# EAGLE design etch-a-sketch (EAGLE 9.6.2)
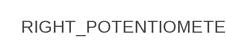
[diagram p0: schematic, sheet 1, part 1 of 2]
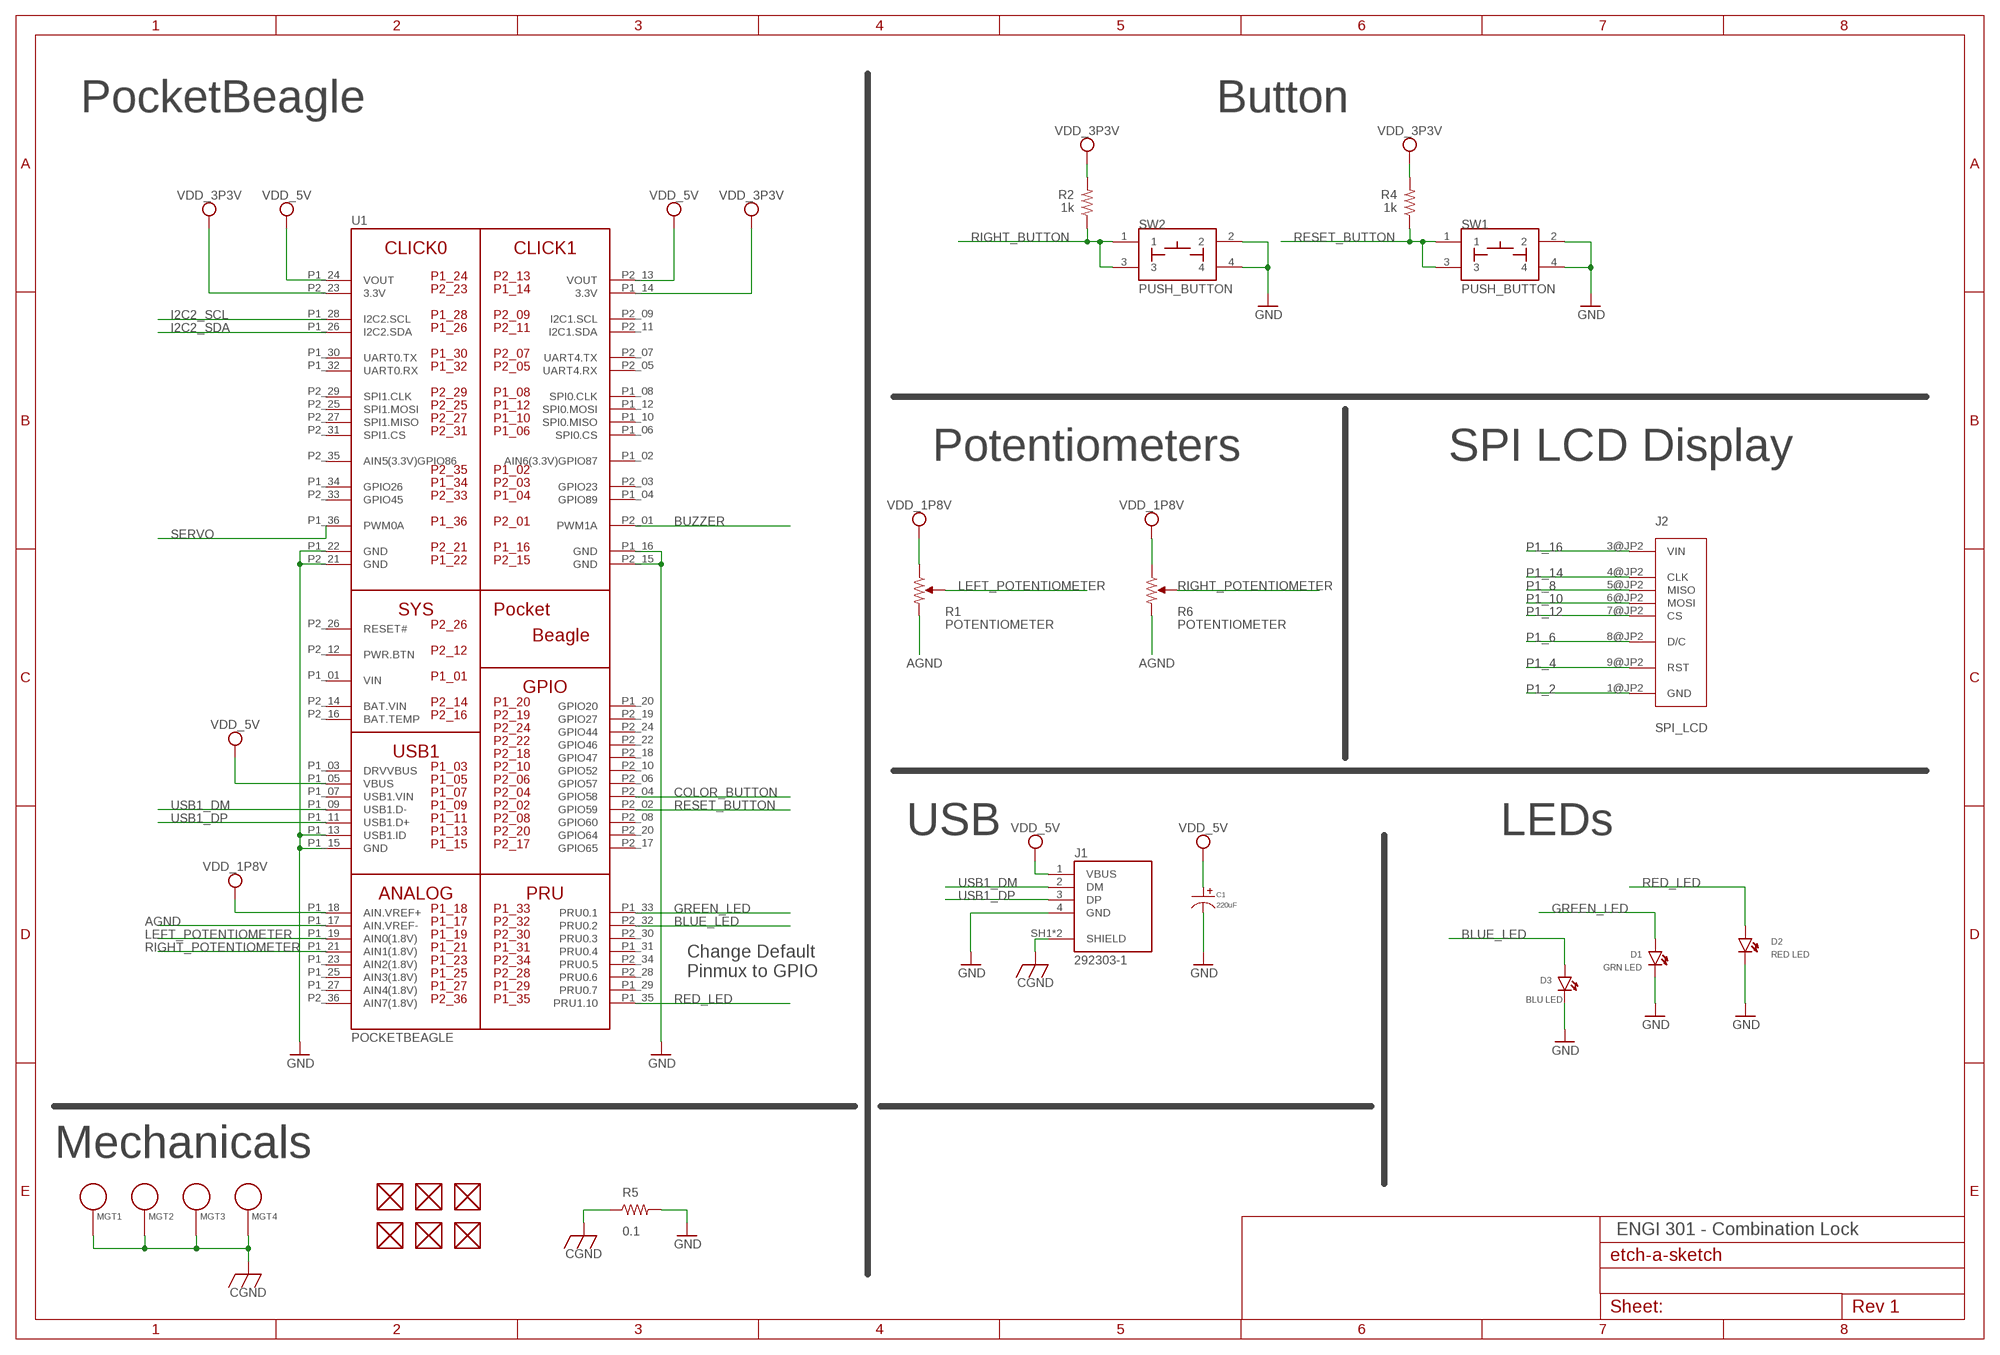
[diagram p1: schematic, sheet 1, part 2 of 2]

## Parts
C1  220uF  CAPACITOR_P_10MM  [CP10MM]
D1  GRN LED  LED  [EIA-STD]
D2  RED LED  LED  [EIA-STD]
D3  GRN LED  LED  [EIA-STD]
FUD1  FIDUCIAL  [FIDUCIAL_40MIL]
FUD2  FIDUCIAL  [FIDUCIAL_40MIL]
FUD3  FIDUCIAL  [FIDUCIAL_40MIL]
FUD4  FIDUCIAL  [FIDUCIAL_40MIL]
FUD5  FIDUCIAL  [FIDUCIAL_40MIL]
FUD6  FIDUCIAL  [FIDUCIAL_40MIL]
J1  292303-1  [TE_292303-1]
J2  SPI_LCD  [TFT_LCD_PCB]
MGT1  MOUNTING_HOLE  [MOUNTING_HOLE]
MGT2  MOUNTING_HOLE  [MOUNTING_HOLE]
MGT3  MOUNTING_HOLE  [MOUNTING_HOLE]
MGT4  MOUNTING_HOLE  [MOUNTING_HOLE]
R1  POTENTIOMETER  [POT-PO90S]
R2  1k  R_R0603  [R0603]
R4  1k  R_R0603  [R0603]
R5  0.1  R_R0805  [R0805]
R6  POTENTIOMETER  [POT-PO90S]
SW1  PUSH_BUTTON  [BUTTON_12.5MM]
SW2  PUSH_BUTTON  [BUTTON_12.5MM]
U1  POCKETBEAGLE  [POCKETBEAGLE]

## Nets
AGND: R1.CW R6.CW U1.P1_17(AIN.VREF-)
AGND1: U1.P1_21(AIN1(1.8V))
BUTTON1: U1.P2_04(GPIO58)
BUZZER: U1.P2_01(PWM1A)
CGND: J1.SH1(SHIELD) J1.SH2(SHIELD) MGT1.P$1 MGT2.P$1 MGT3.P$1 MGT4.P$1 R5.1
GND: C1.P$2 D1.CATHODE D2.CATHODE D3.CATHODE J1.4(GND) R5.2 SW1.2 SW1.4 SW2.2 SW2.4 U1.P1_13(USB1.ID) U1.P1_15(GND) U1.P1_16(GND) U1.P1_22(GND) U1.P2_15(GND) U1.P2_21(GND)
GREEN_LED: D1.ANODE D3.ANODE U1.P1_33(PRU0.1)
GREEN_LED1: U1.P2_32(PRU0.2)
I2C2_SCL: U1.P1_28(I2C2.SCL)
I2C2_SDA: U1.P1_26(I2C2.SDA)
LEFT_POTENTIOMETER: R1.S R6.S U1.P1_19(AIN0(1.8V))
N$1: J2.3@JP2(VIN)
N$2: J2.4@JP2(CLK)
N$3: J2.5@JP2(MISO)
N$4: J2.6@JP2(MOSI)
N$5: J2.7@JP2(CS)
N$6: J2.8@JP2(D/C)
N$7: J2.9@JP2(RST)
N$8: J2.1@JP2(GND)
RED_LED: D2.ANODE U1.P1_35(PRU1.10)
RESET_BUTTON: R2.1 R4.1 SW1.1 SW1.3 SW2.1 SW2.3 U1.P2_02(GPIO59)
SERVO: U1.P1_36(PWM0A)
USB1_DM: J1.2(DM) U1.P1_09(USB1.D-)
USB1_DP: J1.3(DP) U1.P1_11(USB1.D+)
VDD_1P8V: R1.CCW R6.CCW U1.P1_18(AIN.VREF+)
VDD_3P3V: R2.2 R4.2 U1.P1_14(3.3V) U1.P2_23(3.3V)
VDD_5V: C1.P$1 J1.1(VBUS) U1.P1_05(VBUS) U1.P1_24(VOUT) U1.P2_13(VOUT)
Unconnected: FUD1.P$1 FUD2.P$1 FUD3.P$1 FUD4.P$1 FUD5.P$1 FUD6.P$1 U1.P1_02(AIN6(3.3V)GPIO87) U1.P1_03(DRVVBUS) U1.P1_04(GPIO89) U1.P1_06(SPI0.CS) U1.P1_07(USB1.VIN) U1.P1_08(SPI0.CLK) U1.P1_10(SPI0.MISO) U1.P1_12(SPI0.MOSI) U1.P1_20(GPIO20) U1.P1_23(AIN2(1.8V)) U1.P1_25(AIN3(1.8V)) U1.P1_27(AIN4(1.8V)) U1.P1_29(PRU0.7) U1.P1_30(UART0.TX) U1.P1_31(PRU0.4) U1.P1_32(UART0.RX) U1.P1_34(GPIO26) U1.P2_03(GPIO23) U1.P2_05(UART4.RX) U1.P2_06(GPIO57) U1.P2_07(UART4.TX) U1.P2_08(GPIO60) U1.P2_09(I2C1.SCL) U1.P2_10(GPIO52) U1.P2_11(I2C1.SDA) U1.P2_12(PWR.BTN) U1.P2_16(BAT.TEMP) U1.P2_17(GPIO65) U1.P2_18(GPIO47) U1.P2_19(GPIO27) U1.P2_20(GPIO64) U1.P2_22(GPIO46) U1.P2_24(GPIO44) U1.P2_25(SPI1.MOSI) U1.P2_26(RESET#) U1.P2_27(SPI1.MISO) U1.P2_28(PRU0.6) U1.P2_29(SPI1.CLK) U1.P2_30(PRU0.3) U1.P2_31(SPI1.CS) U1.P2_33(GPIO45) U1.P2_34(PRU0.5) U1.P2_35(AIN5(3.3V)GPIO86) U1.P2_36(AIN7(1.8V))

## Notes on the sheet
- PocketBeagle | Button
- RIGHT_BUTTON
- Potentiometers | SPI LCD Display
- P1_16
- P1_14
- RIGHT_POTENTIOMETER | P1_8
- P1_10
- P1_12
- P1_6
- P1_4
- P1_2
- COLOR_BUTTON
- USB | LEDs
- BLUE_LED
- BLUE_LED
- RIGHT_POTENTIOMETER
- Change Default 
  Pinmux to GPIO
- BLU LED
- Mechanicals
- ENGI 301 - Combination Lock
- RIGHT_POTENTIOMETER

## Power pins joined to a net without a drawn wire
BAT.VIN: U1.P2_14(BAT.VIN)
VIN: U1.P1_01(VIN)

## Library data of the parts
C1 = combo_lock:CAPACITOR_P: Library: MF_Passives Description: Device for Polarized Capacitors. Manufacture part number (MPN), Voltage Rating, and Tolerance can be added via Attributes. Check https://factory.macrofab.com/parts for the house parts list.; POPULATE: 1
D1-D3 = combo_lock:LED: EIA-STD LED, LTST-C191TBKT
FUD1-FUD6 = combo_lock:FIDUCIAL
J1 = combo_lock:292303-1: CONN USB RECEPT R/A TYPE A 4POS Check availability <https://pricing.snapeda.com/parts/292303-1/TE%20Connectivity/view-part?ref=eda>; AVAILABILITY: In Stock; CENTERLINE_PITCH: 2 mm[.078 in]; COMMENT: 292303-1; DESCRIPTION: Conn; Data; USB; Recept; 2.0; 4 Pos; 1 Port; Rt Angle; A Ser; Tin over Copper; EU_ROHS_COMPLIANCE: Compliant; MF: TE Connectivity; MP: 292303-1; NUMBER_OF_POSITIONS: 4; PACKAGE: None; PRICE: None; PRODUCT_TYPE: Connector; PURCHASE-URL: https://pricing.snapeda.com/search/part/292303-1/?ref=eda
J2 = Etch-a-sketch:SPI_LCD
MGT1-MGT4 = combo_lock:MOUNTING_HOLE: Chassis Mounting Hole w/GND connection ability
R1 R6 = combo_lock:POTENTIOMETER: Potentiometer - Examples: P090S-14T20BR10K (987-1277-ND)
R2 R4 R5 = combo_lock:R_: RESISTOR, American symbol
SW1 SW2 = combo_lock:PUSH_BUTTON
U1 = combo_lock:POCKETBEAGLE

## Board
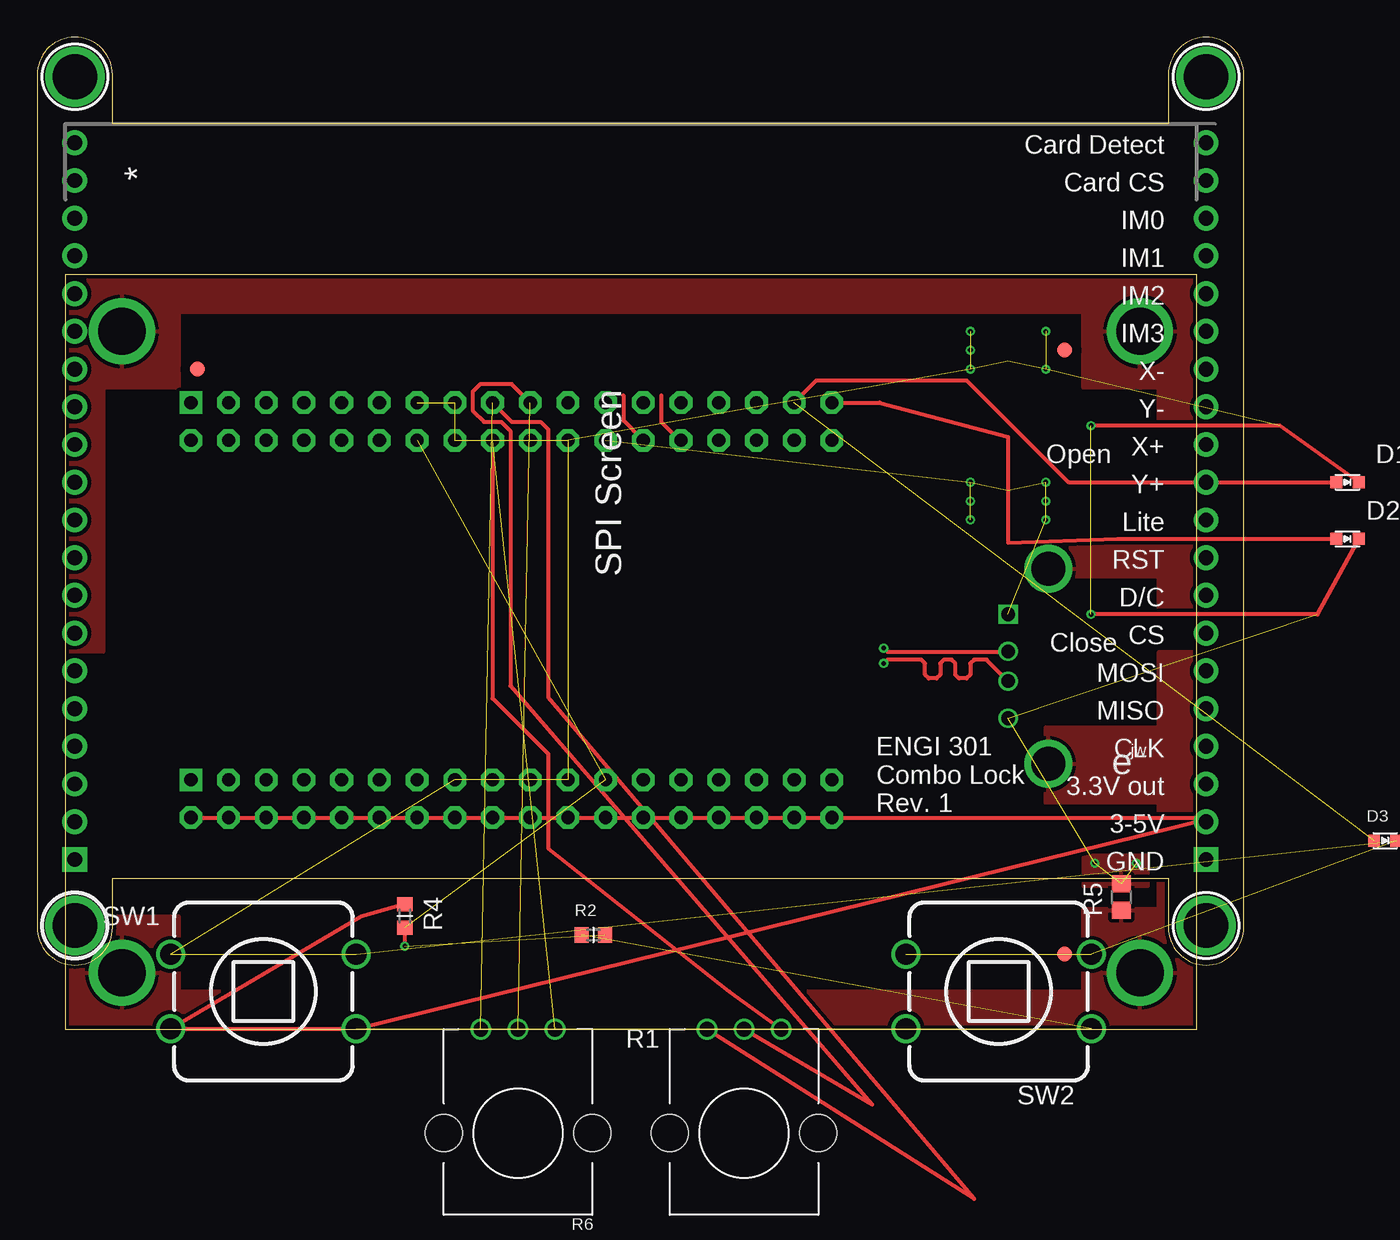
[diagram p2: board, top side]
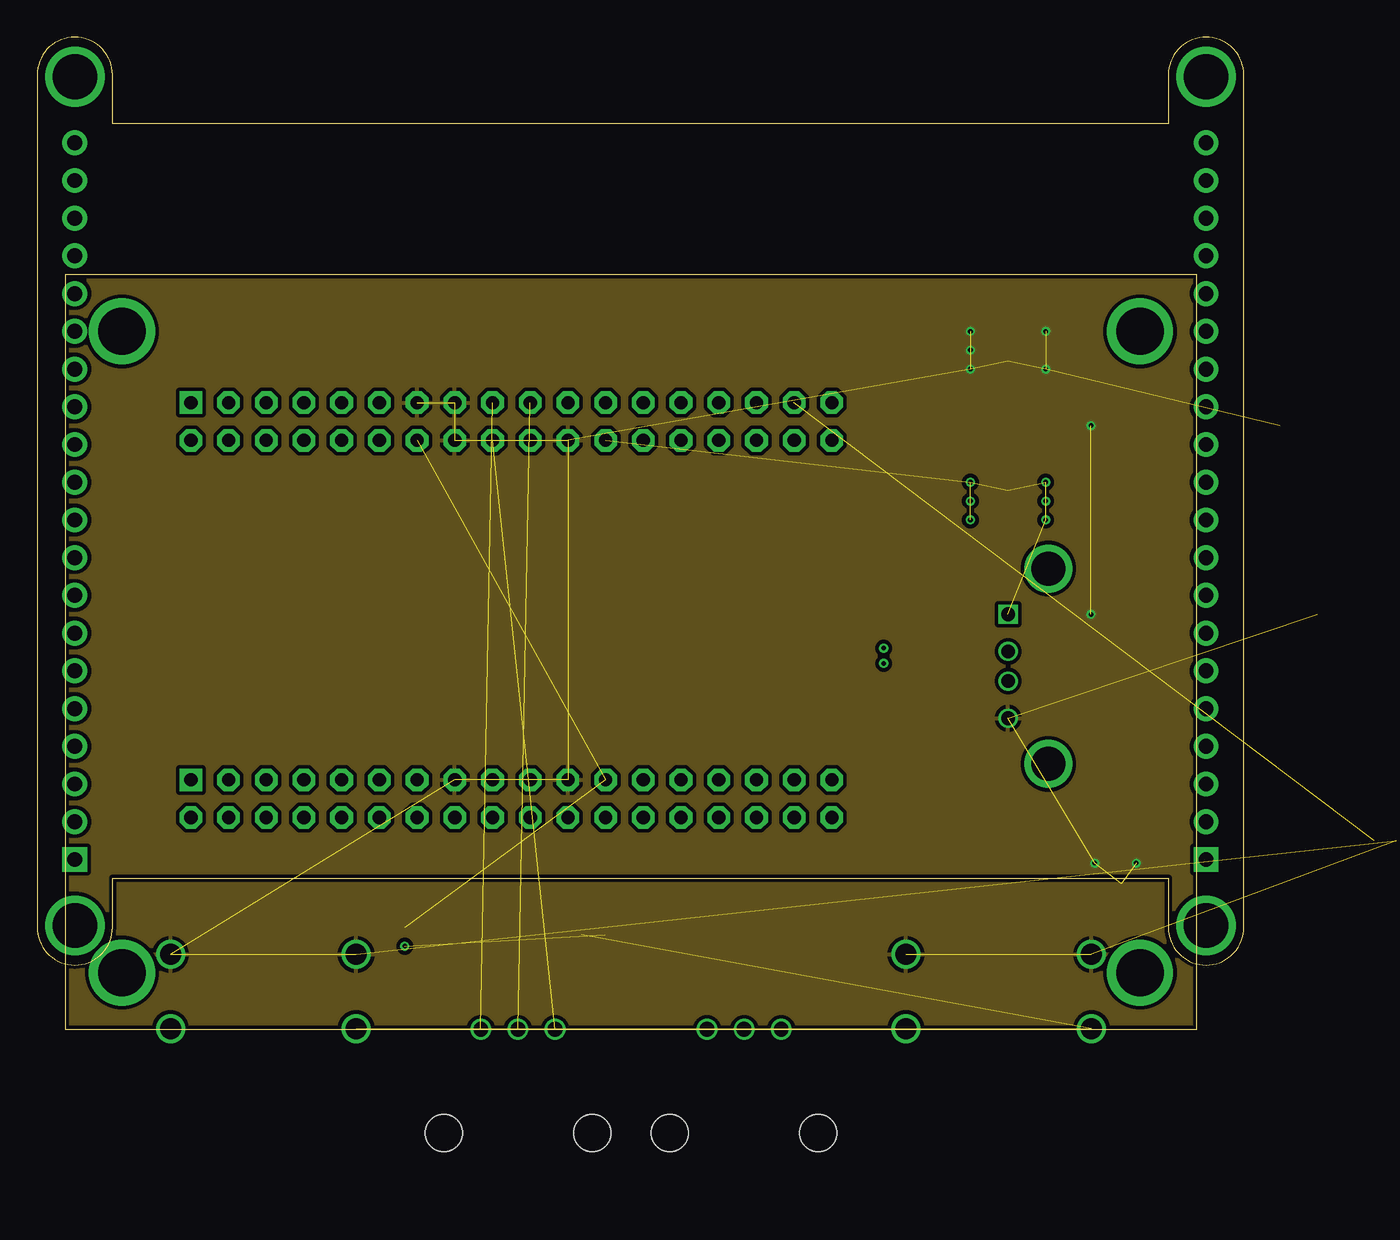
[diagram p3: board, inner layer Route2]
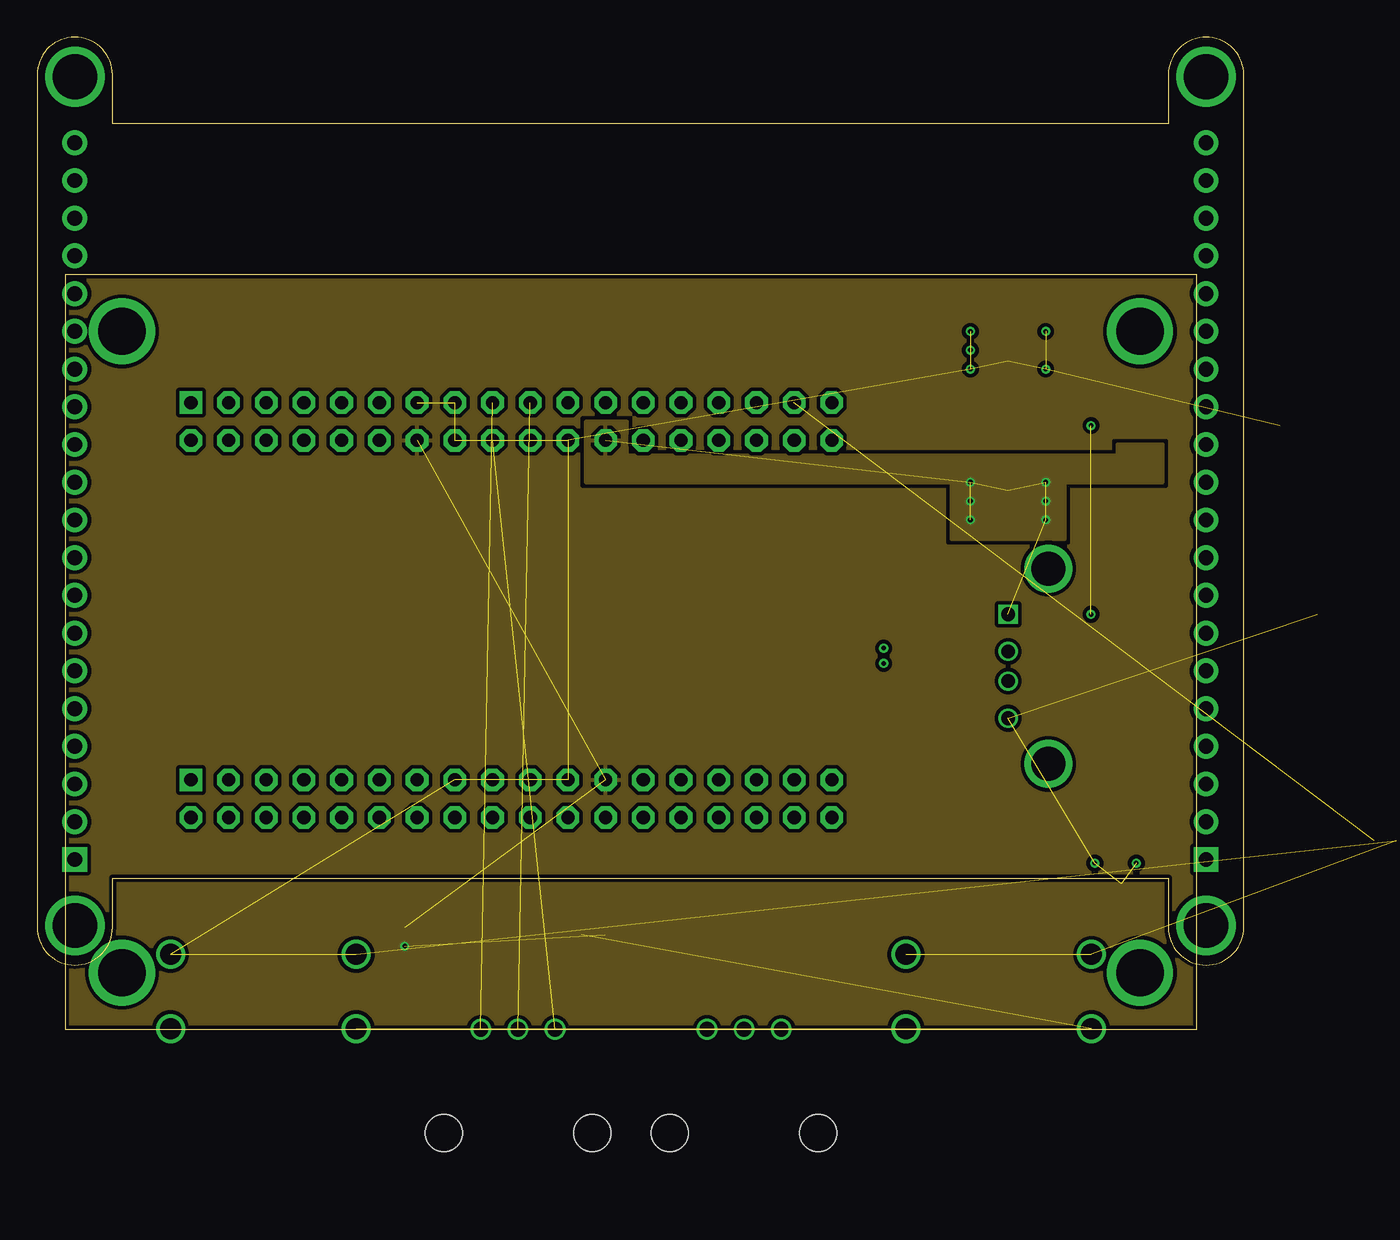
[diagram p4: board, inner layer Route15]
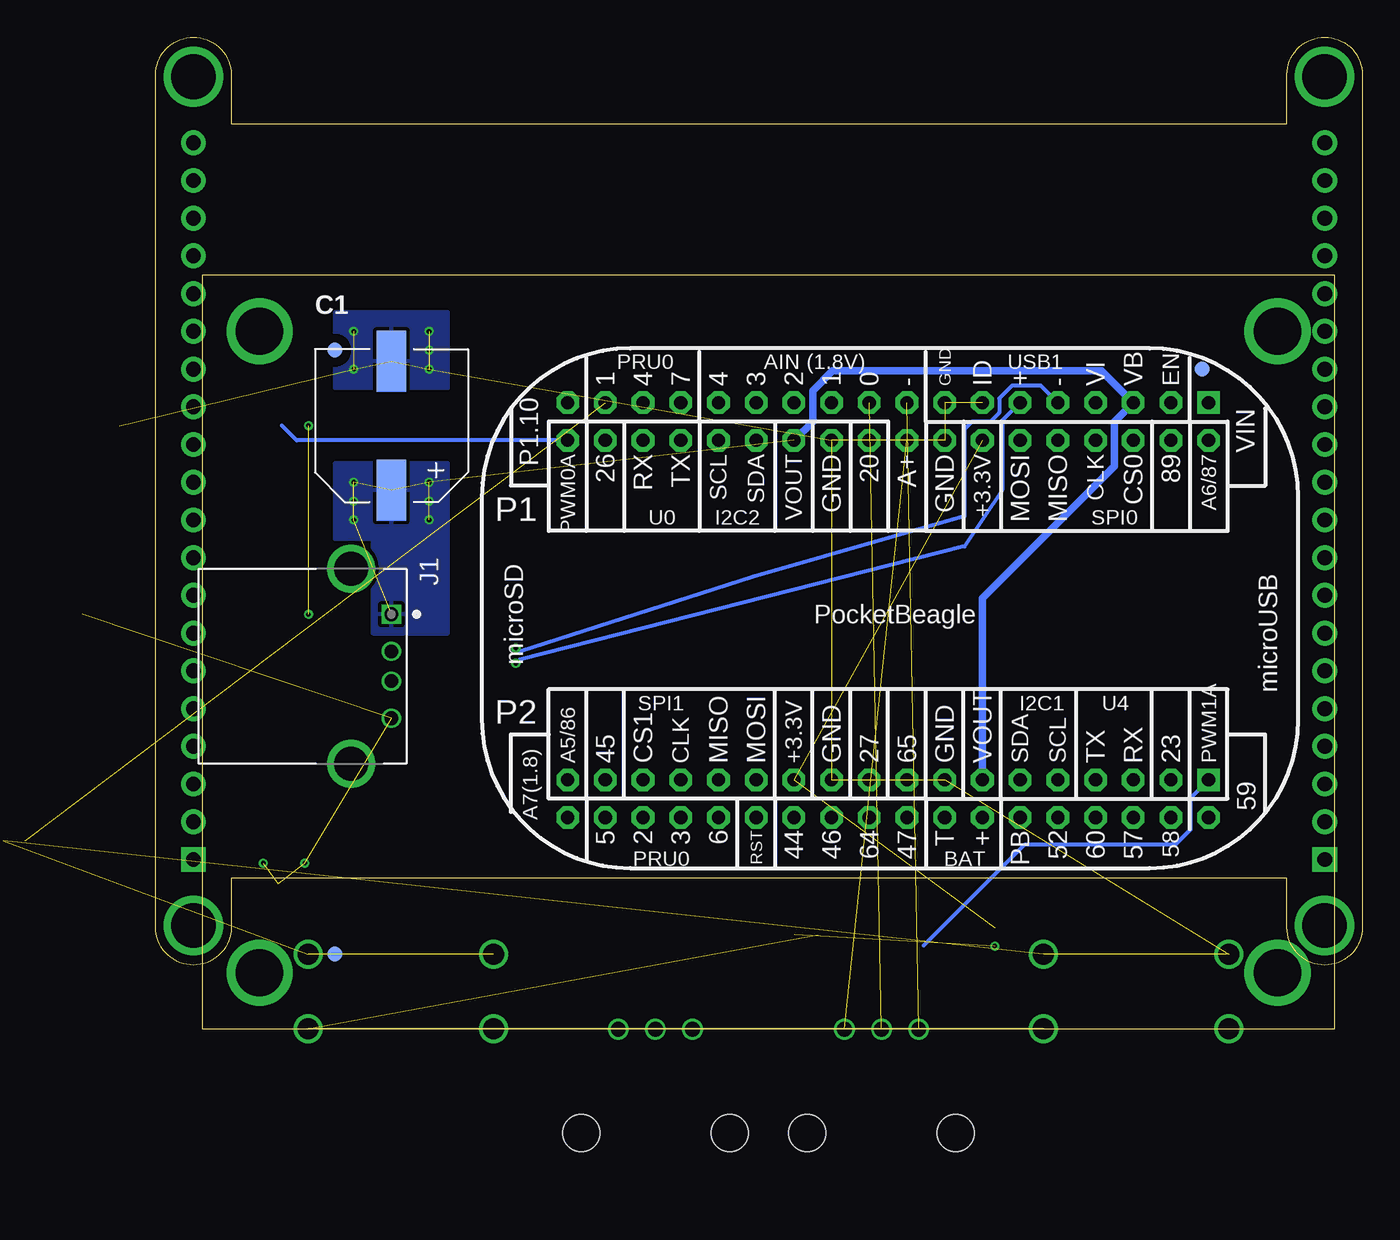
[diagram p5: board, bottom side, seen from below]

Size 81.28 x 66.8 mm. Coordinates in mm from the lower left corner, seen from the top.
Outline: 1.91,0 78.11,0 78.11,50.8 1.91,50.8 1.91,0
Copper layers (1*2*15*16): Top 0.035mm / dielectric 0.23mm / Route2 0.035mm / dielectric 0.93mm / Route15 0.035mm / dielectric 0.23mm / Bottom 0.035mm
Design rules "ENGI301_4lyr": minimum track width 10mil, minimum drill 12mil, track to track 10mil, track to pad 10mil, pad to pad 10mil, via to via 10mil, smd to smd 10mil, copper to edge 10mil, drill to drill 12mil, minimum pad ring 6mil, minimum via ring 6mil, stop-mask expansion 3mil, vias tented up to drill 25mil, thermal gap 10mil

### Footprints (pad centres in the part's own frame; a part is rotated, then mirrored left to right if it is on the bottom)
CP10MM = smd 2 x 4.1: P$1 0,-4.35; P$2 0,4.35
EIA-STD = smd 0.8 x 0.8: ANODE -0.75,0; CATHODE 0.75,0
FIDUCIAL_40MIL = smd 1.016 x 1.016: P$1 0,0
TE_292303-1 = drill 0.92 square: 1 0,0 | drill 0.92: 2 2.5,0; 3 4.5,0; 4 7,0 | drill 2.3: SH1 -3.07,-2.71; SH2 10.07,-2.71
TFT_LCD_PCB = drill 1 pad 1.676 square: 1@JP1 -24.13,38.1; 1@JP2 -24.13,-38.1 | drill 1 pad 1.676: 2@JP1 -21.59,38.1; 2@JP2 -21.59,-38.1; 3@JP1 -19.05,38.1; 3@JP2 -19.05,-38.1; 4@JP1 -16.51,38.1; 4@JP2 -16.51,-38.1; 5@JP1 -13.97,38.1; 5@JP2 -13.97,-38.1; 6@JP1 -11.43,38.1; 6@JP2 -11.43,-38.1; 7@JP1 -8.89,38.1; 7@JP2 -8.89,-38.1; 8@JP1 -6.35,38.1; 8@JP2 -6.35,-38.1; 9@JP1 -3.81,38.1; 9@JP2 -3.81,-38.1; 10@JP1 -1.27,38.1; 10@JP2 -1.27,-38.1; 11@JP1 1.27,38.1; 11@JP2 1.27,-38.1; 12@JP1 3.81,38.1; 12@JP2 3.81,-38.1; 13@JP1 6.35,38.1; 13@JP2 6.35,-38.1; 14@JP1 8.89,38.1; 14@JP2 8.89,-38.1; 15@JP1 11.43,38.1; 15@JP2 11.43,-38.1; 16@JP1 13.97,38.1; 16@JP2 13.97,-38.1; 17@JP1 16.51,38.1; 17@JP2 16.51,-38.1; 18@JP1 19.05,38.1; 18@JP2 19.05,-38.1; 19@JP1 21.59,38.1; 19@JP2 21.59,-38.1; 20@JP1 24.13,38.1; 20@JP2 24.13,-38.1 | drill 3 pad 3.6: P$1@U$7 -28.575,-38.1; P$1@U$15 28.575,-38.1; P$1@U$16 -28.575,38.1; P$1@U$17 28.575,38.1
MOUNTING_HOLE = drill 3.175 pad 4.445: P$1 0,0
POT-PO90S = drill 1: CCW -2.5,0; CW 2.5,0; S 0,0 | hole 2.5: -5,7; 5,7
R0603 = smd 0.95 x 1.031: 1 -0.8,0; 2 0.8,0
R0805 = smd 1.143 x 1.27: 1 -0.889,0; 2 0.889,0
BUTTON_12.5MM = drill 1.4: 1 -6.25,2.5; 2 -6.25,-2.5; 3 6.25,2.5; 4 6.25,-2.5
POCKETBEAGLE = drill 0.889 pad 1.524 square: P1_01 5.91,3.53; P2_01 5.91,28.93 | drill 0.889 pad 1.524 octagon: P1_02 5.91,6.07; P1_03 8.45,3.53; P1_04 8.45,6.07; P1_05 10.99,3.53; P1_06 10.99,6.07; P1_07 13.53,3.53; P1_08 13.53,6.07; P1_09 16.07,3.53; P1_10 16.07,6.07; P1_11 18.61,3.53; P1_12 18.61,6.07; P1_13 21.15,3.53; P1_14 21.15,6.07; P1_15 23.69,3.53; P1_16 23.69,6.07; P1_17 26.23,3.53; P1_18 26.23,6.07; P1_19 28.77,3.53; P1_20 28.77,6.07; P1_21 31.31,3.53; P1_22 31.31,6.07; P1_23 33.85,3.53; P1_24 33.85,6.07; P1_25 36.39,3.53; P1_26 36.39,6.07; P1_27 38.93,3.53; P1_28 38.93,6.07; P1_29 41.47,3.53; P1_30 41.47,6.07; P1_31 44.01,3.53; P1_32 44.01,6.07; P1_33 46.55,3.53; P1_34 46.55,6.07; P1_35 49.09,3.53; P1_36 49.09,6.07; P2_02 5.91,31.47; P2_03 8.45,28.93; P2_04 8.45,31.47; P2_05 10.99,28.93; P2_06 10.99,31.47; P2_07 13.53,28.93; P2_08 13.53,31.47; P2_09 16.07,28.93; P2_10 16.07,31.47; P2_11 18.61,28.93; P2_12 18.61,31.47; P2_13 21.15,28.93; P2_14 21.15,31.47; P2_15 23.69,28.93; P2_16 23.69,31.47; P2_17 26.23,28.93; P2_18 26.23,31.47; P2_19 28.77,28.93; P2_20 28.77,31.47; P2_21 31.31,28.93; P2_22 31.31,31.47; P2_23 33.85,28.93; P2_24 33.85,31.47; P2_25 36.39,28.93; P2_26 36.39,31.47; P2_27 38.93,28.93; P2_28 38.93,31.47; P2_29 41.47,28.93; P2_30 41.47,31.47; P2_31 44.01,28.93; P2_32 44.01,31.47; P2_33 46.55,28.93; P2_34 46.55,31.47; P2_35 49.09,28.93; P2_36 49.09,31.47

### Placement (x,y rotation side)
C1  65.41,40.64 0 bottom
D1  88.27,36.83 0 top  (outside the outline)
D2  88.27,33.02 0 top  (outside the outline)
D3  90.81,12.7 0 top  (outside the outline)
FUD1  69.22,45.72 0 top
FUD2  69.22,5.08 0 top
FUD3  10.8,44.45 0 bottom
FUD4  69.22,45.72 0 bottom
FUD5  69.22,5.08 0 bottom
FUD6  10.8,44.45 0 top
J1  65.41,27.94 270 bottom
J2  40.64,35.56 90 top
MGT1  5.72,46.99 0 top
MGT2  5.72,3.81 0 top
MGT3  74.3,3.81 0 top
MGT4  74.3,46.99 0 top
R1  47.62,0 180 top
R2  37.47,6.35 0 top
R4  24.77,7.62 270 top
R5  73.03,8.89 90 top
R6  32.39,0 180 top
SW1  15.24,2.54 180 top
SW2  64.77,2.54 180 top
U1  4.45,45.72 180 bottom

### Tracks (layer width: path | path; a pad name or v marks a point on that pad's centre or on a via)
AGND  (1 unrouted)
  Top 0.254: U1.P1_17 31.97,40.89 33.91,40.89 34.42,40.39 34.42,22.35 63.12,-11.43 R1.CW
BUZZER
  Bottom 0.254: U1.P2_01 11.56,15.59 11.56,13.46 12.57,12.45 22.73,12.45 29.54,5.64
CGND
  pour Top: -0.63,-2.54 -0.63,25.4 4.45,25.4 4.45,7.62 9.53,7.62 9.53,2.54 70.48,2.54 70.48,8.13 75.56,8.13 75.56,15.24 67.95,15.24 67.95,20.32 74.3,20.32 75.56,20.32 75.56,21.59 75.56,25.4 80.64,25.4 80.64,-2.54
  pour Top: -0.63,25.4 -0.63,53.34 80.64,53.34 80.64,25.4 75.56,25.4 75.56,30.48 67.95,30.48 67.95,33.02 75.56,33.02 75.56,43.18 70.48,43.18 70.48,48.26 9.53,48.26 9.53,43.18 4.45,43.18 4.45,25.4
GND  (via drill 0.3 pad 0.61)  (22 unrouted)
  Top 0.254: D2.CATHODE 86.23,27.94 v70.99,27.94 | D1.CATHODE 83.69,40.64 v70.99,40.64
  other vias: 71.25,11.18 74.04,11.18 62.87,46.99 62.87,45.72 62.87,44.45 67.95,44.45 67.95,46.99
  pour Route2: -3.17,55.88 80.64,55.88 83.19,55.88 83.19,-5.08 -3.17,-5.08
  pour Top: 70.48,9.65 74.8,9.65 74.8,11.68 70.48,11.68
  pour Bottom: 61.59,43.18 61.59,48.26 69.22,48.26 69.22,43.18
GREEN_LED  (1 unrouted)
  Top 0.254: U1.P1_33 52.49,43.69 62.61,43.69 69.47,36.83 D1.ANODE
I2C2_SCL
  Top 0.254: 42.04,42.67 42.04,40.89 43.28,39.65 U1.P1_28 43.31,39.58
I2C2_SDA
  Top 0.254: U1.P1_26 40.77,39.72 40.69,39.8 39.5,40.99 39.5,42.67
LEFT_POTENTIOMETER  (1 unrouted)
  Top 0.254: U1.P1_19 31.97,43.43 29.85,43.43 29.34,42.93 29.34,41.66 30.1,40.89 31.25,40.89 31.88,40.27 31.88,23.11 56.26,-5.08 R1.S
RED_LED
  Top 0.254: U1.P1_35 56.74,42.19 65.41,39.88 65.41,32.77 72.77,33.02 D2.ANODE
RESET_BUTTON  (3 unrouted)
  Top 0.254: R4.1 21.8,7.58 SW1.3 SW1.1 79.16,14.25 U1.P2_02
SERVO
  Bottom 0.254: U1.P1_36 71.78,39.65 72.77,40.64
USB1_DM  (via drill 0.3 pad 0.61)
  Top 0.254: v57.02,25.65 57.28,25.4 65.37,25.4 J1.2
  Bottom 0.254: U1.P1_09 21.66,43.33 23.6,43.33 24.45,42.48 24.45,41.51 25.07,40.89 26.29,40.89 26.8,40.39 26.8,34.54 41.02,30.48 56.77,25.4 v57.02,25.65
USB1_DP  (via drill 0.3 pad 0.61)
  Top 0.254: v57.02,24.64 57.28,24.89 59.56,24.89 59.82,24.64 59.82,23.88 60.07,23.62 60.58,23.62 60.83,23.88 60.83,24.64 61.09,24.89 61.59,24.89 61.85,24.64 61.85,23.88 62.1,23.62 62.61,23.62 62.87,23.88 62.87,24.64 63.12,24.89 63.95,24.89 J1.3
  Bottom 0.254: U1.P1_11 24.26,40.99 24.26,36.32 26.8,32.51 56.77,24.89 v57.02,24.64
VDD_1P8V  (1 unrouted)
  Top 0.254: U1.P1_18 30.68,22.28 34.42,18.54 34.42,12.19 46.61,2.54 R1.CCW
VDD_3P3V  (via drill 0.3 pad 0.61)  (3 unrouted)
  Top 0.254: R4.2 v24.77,5.59
  pour Route15 (rank 6): -5.71,58.42 85.72,58.42 85.72,-7.62 -5.71,-7.62
VDD_5V  (via drill 0.3 pad 0.61)  (8 unrouted)
  Bottom 0.508: U1.P2_13 25.6,29.02 16.71,37.91 16.71,40.92 U1.P1_05 17.57,44.32 35.69,44.32 37.02,42.98 37.02,40.92 U1.P1_24
  other vias: 62.87,36.83 67.95,36.83 67.95,35.56 67.95,34.29 62.87,35.56 62.87,34.29
  pour Route15: 36.96,40.89 36.96,36.83 61.59,36.83 61.59,33.02 69.22,33.02 69.22,36.83 75.82,36.83 75.82,39.37 72.77,39.37 72.77,38.61 39.75,38.61 39.75,40.89
  pour Bottom: 61.59,26.67 61.59,38.1 69.22,38.1 69.22,33.02 66.67,33.02 66.67,26.67

### Text on the board
tPlace: Open | Close | jw | ENGI 301 / Combo Lock | e | Rev. 1